# Altium project upper-pcb.PrjPcb
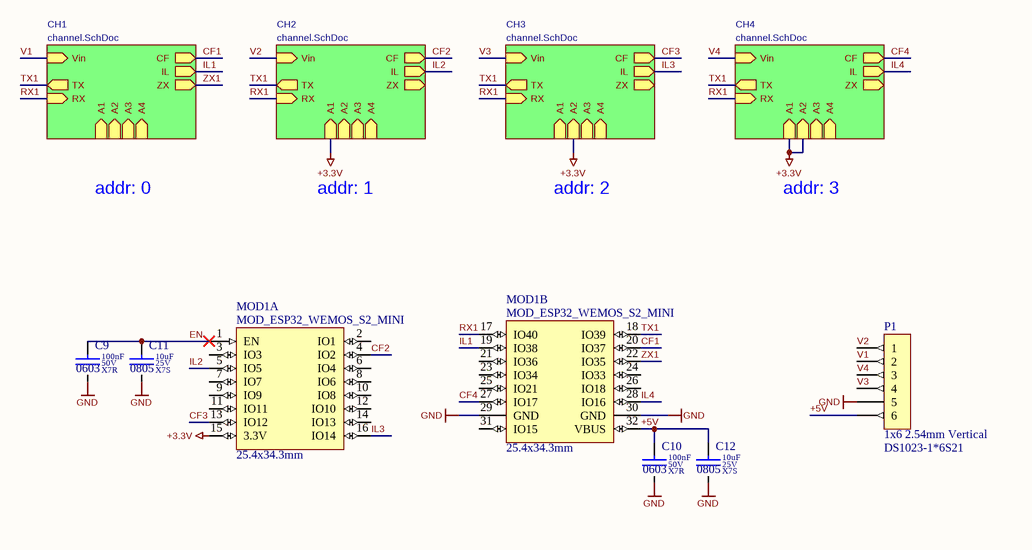
[diagram p0: upper-pcb.SchDoc]
2 sheets, 82 parts. Net scope: hierarchical (ports join the sheet entries above them; power ports are global).
Board file: upper-pcb.PcbDoc
Sheets:
  upper-pcb.SchDoc
    CH1 = channel.SchDoc
    CH2 = channel.SchDoc
    CH3 = channel.SchDoc
    CH4 = channel.SchDoc

## Sheet upper-pcb.SchDoc
size A; SheetNumber: 1; SheetTotal: 2

### Parts
C9  value 100nF  Dielectric: X7R  Voltage: 50V  SCH_Footprint: 0603  [C_0603_1608]  (hidden comment: Ceramic X7R)
C10  value 100nF  Dielectric: X7R  Voltage: 50V  SCH_Footprint: 0603  [C_0603_1608]  (hidden comment: Ceramic X7R)
C11  value 10uF  Dielectric: X7S  Voltage: 25V  SCH_Footprint: 0805  [C_0805_2012]  (hidden comment: Ceramic X7S)
C12  value 10uF  Dielectric: X7S  Voltage: 25V  SCH_Footprint: 0805  [C_0805_2012]  (hidden comment: Ceramic X7S)
MOD1  value MOD_ESP32_WEMOS_S2_MINI  SCH_Footprint: 25.4x34.3mm  [MOD_ESP32_WEMOS_S2_MINI]  (hidden comment: ESP32-S2FN4R2 mini wifi board)  (parts A,B of 2)
P1  value DS1023-1*6S21  SCH_Footprint: 1x6 2.54mm Vertical  [J_HEADER_1x6_2.54_VERTICAL]  (hidden comment: Goldpin female straight)

### Sub-sheets
CH1 = channel.SchDoc: Vin (in), ZX (out), IL (out), CF (out), A1 (in), A2 (in), A3 (in), A4 (in), RX (in), TX (out)
CH2 = channel.SchDoc: Vin (in), ZX (out), IL (out), CF (out), A1 (in), A2 (in), A3 (in), A4 (in), RX (in), TX (out)
CH3 = channel.SchDoc: Vin (in), ZX (out), IL (out), CF (out), A1 (in), A2 (in), A3 (in), A4 (in), RX (in), TX (out)
CH4 = channel.SchDoc: Vin (in), ZX (out), IL (out), CF (out), A1 (in), A2 (in), A3 (in), A4 (in), RX (in), TX (out)

### Nets
+3.3V: MOD1.15(3.3V) ; sheet CH2/A1, sheet CH3/A2, sheet CH4/A1, sheet CH4/A2
GND: C9.2 C10.2 C11.2 C12.2 MOD1.29(GND) MOD1.30(GND) P1.5
+5V: C10.1 C12.1 MOD1.32(VBUS) P1.6
CF1: MOD1.20(IO37) ; sheet CH1/CF
CF2: MOD1.4(IO2) ; sheet CH2/CF
CF3: MOD1.13(IO12) ; sheet CH3/CF
CF4: MOD1.27(IO17) ; sheet CH4/CF
EN: C9.1 C11.1 MOD1.1(EN)
IL1: MOD1.19(IO38) ; sheet CH1/IL
IL2: MOD1.5(IO5) ; sheet CH2/IL
IL3: MOD1.16(IO14) ; sheet CH3/IL
IL4: MOD1.28(IO16) ; sheet CH4/IL
RX1: MOD1.17(IO40) ; sheet CH1/RX, sheet CH2/RX, sheet CH3/RX, sheet CH4/RX
TX1: MOD1.18(IO39) ; sheet CH1/TX, sheet CH2/TX, sheet CH3/TX, sheet CH4/TX
V1: P1.2 ; sheet CH1/Vin
V2: P1.1 ; sheet CH2/Vin
V3: P1.4 ; sheet CH3/Vin
V4: P1.3 ; sheet CH4/Vin
ZX1: MOD1.22(IO35) ; sheet CH1/ZX

Not connected (* = marked no-connect by the designer): MOD1 2(IO1) 3(IO3) 6(IO4) 7(IO7) 8(IO6) 9(IO9) 10(IO8) 11(IO11) 12(IO10) 14(IO13) 21(IO36) 23(IO34) 24(IO33) 25(IO21) 26(IO18) 31(IO15)

### Notes on the sheet
- addr: 0
- addr: 1
- addr: 2
- addr: 3

### Library data of the parts
C9 C10 = C_100nF_50V_X7R_0603_5: Capacitor; Manufacturer: Samsung; Manufacturer Part Number: CL10B104JB8NNNC; Tolerance (%): 5; Part Number: C_100nF_50V_X7R_0603_5; HelpURL: http://www.tme.eu/pl/Document/4a42202b32dab16128fe107dd69598cc/samsung-chip-cap.pdf; Supplier 1: TME; Supplier Part Number 1: CL10B104JB8NNNC; Supplier 2: RS Components; Supplier Part Number 2: 7665455; Supplier 3: Farnell; Supplier 4: Mouser; Supplier 5: Digi-Key; Supplier Part Number 5: 1276-1033-1-ND; Supplier 6: LCSC; Supplier Part Number 6: C24452
C11 C12 = C_10uF_25V_X7S_0805_10: Capacitor; Manufacturer: Murata; Manufacturer Part Number: GRT21BC71E106KE13L; Tolerance (%): 10; Part Number: C_10uF_25V_X7S_0805_10; HelpURL: https://eu.mouser.com/datasheet/2/281/1/GRT21BC71E106KE13_01A-3158174.pdf; Supplier 1: TME; Supplier Part Number 1: GRT21BC71E106KE13L; Supplier 2: RS Components; Supplier Part Number 2: 2478205; Supplier 3: Farnell; Supplier Part Number 3: 3790456; Supplier 4: Mouser; Supplier Part Number 4: 81-GRT21BC71E106KE13; Supplier 5: Digi-Key; Supplier Part Number 5: 490-GRT21BC71E106KE13LCT-ND; Supplier 6: LCSC
MOD1 = MOD_ESP32_WEMOS_S2_MINI: Manufacturer: Wemos; Part Number: MOD_ESP32_WEMOS_S2_MINI; HelpURL: https://www.wemos.cc/en/latest/s2/s2_mini.html; Manufacturer Part Number: MOD_ESP32_WEMOS_S2_MINI; Supplier 1: TME; Supplier 2: RS Components; Supplier 3: Farnell; Supplier 4: Mouser; Supplier 5: Digi-Key; Supplier 6: LCSC; Supplier 7: Aliexpress; Supplier Part Number 7: https://pl.aliexpress.com/item/1005003145192016.html
P1 = J_HEADER_1x6_2.54_VERTICAL: Pin Header; Manufacturer: Connfly; Part Number: J_HEADER_1x6_2.54_VERTICAL; HelpURL: https://www.tme.eu/Document/584b1a60cf2e8809a936c5f5ff2de0d5/zl262-sg.pdf; Manufacturer Part Number: DS1023-1*6S21; Supplier 1: TME; Supplier Part Number 1: ZL262-6SG; Supplier 2: RS Components; Supplier 3: Farnell; Supplier 4: Mouser; Supplier 5: Digi-Key; Supplier 6: LCSC

## Sheet channel.SchDoc
size A; SheetNumber: 2; SheetTotal: 2
Used 4 times, as channels CH1, CH2, CH3, CH4. Parts and nets are listed once, with the designators drawn on the sheet.
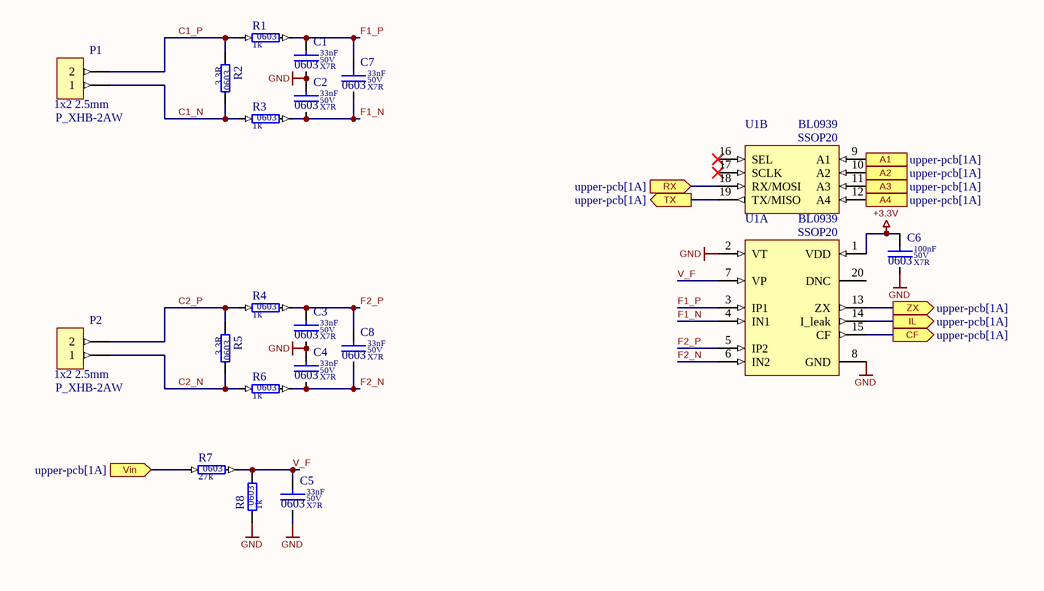
[diagram p1: channel.SchDoc]

### Parts
C1  value 33nF  Dielectric: X7R  Voltage: 50V  SCH_Footprint: 0603  [C_0603_1608]  (hidden comment: Ceramic X7R)
C2  value 33nF  Dielectric: X7R  Voltage: 50V  SCH_Footprint: 0603  [C_0603_1608]  (hidden comment: Ceramic X7R)
C3  value 33nF  Dielectric: X7R  Voltage: 50V  SCH_Footprint: 0603  [C_0603_1608]  (hidden comment: Ceramic X7R)
C4  value 33nF  Dielectric: X7R  Voltage: 50V  SCH_Footprint: 0603  [C_0603_1608]  (hidden comment: Ceramic X7R)
C5  value 33nF  Dielectric: X7R  Voltage: 50V  SCH_Footprint: 0603  [C_0603_1608]  (hidden comment: Ceramic X7R)
C6  value 100nF  Dielectric: X7R  Voltage: 50V  SCH_Footprint: 0603  [C_0603_1608]  (hidden comment: Ceramic X7R)
C7  value 33nF  Dielectric: X7R  Voltage: 50V  SCH_Footprint: 0603  [C_0603_1608]  (hidden comment: Ceramic X7R)
C8  value 33nF  Dielectric: X7R  Voltage: 50V  SCH_Footprint: 0603  [C_0603_1608]  (hidden comment: Ceramic X7R)
P1  value P_XHB-2AW  SCH_Footprint: 1x2 2.5mm  [P_XHB-2AW]  (hidden comment: XHB)
P2  value P_XHB-2AW  SCH_Footprint: 1x2 2.5mm  [P_XHB-2AW]  (hidden comment: XHB)
R1  value 1k  SCH_Footprint: 0603  [R_0603_1608]  (hidden comment: Resistor)
R2  value 3.3R  SCH_Footprint: 0603  [R_0603_1608]  (hidden comment: Resistor)
R3  value 1k  SCH_Footprint: 0603  [R_0603_1608]  (hidden comment: Resistor)
R4  value 1k  SCH_Footprint: 0603  [R_0603_1608]  (hidden comment: Resistor)
R5  value 3.3R  SCH_Footprint: 0603  [R_0603_1608]  (hidden comment: Resistor)
R6  value 1k  SCH_Footprint: 0603  [R_0603_1608]  (hidden comment: Resistor)
R7  value 27k  SCH_Footprint: 0603  [R_0603_1608]  (hidden comment: Resistor)
R8  value 1k  SCH_Footprint: 0603  [R_0603_1608]  (hidden comment: Resistor)
U1  value BL0939  SCH_Footprint: SSOP20  [SSOP20_3.9x8.65]  (hidden comment: Electrical mains 2-ch power meter)  (parts A,B of 2)

### Ports
A1 (in, see upper-pcb[1A]), A2 (in, see upper-pcb[1A]), A3 (in, see upper-pcb[1A]), A4 (in, see upper-pcb[1A]), CF (out, see upper-pcb[1A]), IL (out, see upper-pcb[1A]), RX (in, see upper-pcb[1A]), TX (out, see upper-pcb[1A]), Vin (in, see upper-pcb[1A]), ZX (out, see upper-pcb[1A])

### Nets
+3.3V: C6.1 U1.1(VDD)
GND: C1.2 C2.1 C3.2 C4.1 C5.2 C6.2 R8.1 U1.2(VT) U1.8(GND)
A1: U1.9(A1) ; port A1
A2: U1.10(A2) ; port A2
A3: U1.11(A3) ; port A3
A4: U1.12(A4) ; port A4
C1_N: P1.1 R2.2 R3.1
C1_P: P1.2 R1.1 R2.1
C2_N: P2.1 R5.2 R6.1
C2_P: P2.2 R4.1 R5.1
CF: U1.15(CF) ; port CF
F1_N: C2.2 C7.2 R3.2 U1.4(IN1)
F1_P: C1.1 C7.1 R1.2 U1.3(IP1)
F2_N: C4.2 C8.2 R6.2 U1.6(IN2)
F2_P: C3.1 C8.1 R4.2 U1.5(IP2)
IL: U1.14(I_leak) ; port IL
RX: U1.18(RX/MOSI) ; port RX
TX: U1.19(TX/MISO) ; port TX
V_F: C5.1 R7.2 R8.2 U1.7(VP)
Vin: R7.1 ; port Vin
ZX: U1.13(ZX) ; port ZX

Not connected (* = marked no-connect by the designer): U1 16(SEL)* 17(SCLK)* 20(DNC)

### Channels
CH1: designators C1=C1_ch1 C2=C2_ch1 C3=C3_ch1 C4=C4_ch1 C5=C5_ch1 C6=C6_ch1 C7=C7_ch1 C8=C8_ch1 P1=P1_CH1 P2=P2_CH1 R1=R1_ch1 R2=R2_ch1 R3=R3_ch1 R4=R4_ch1 R5=R5_ch1 R6=R6_ch1 R7=R7_ch1 R8=R8_ch1 U1=U1_ch1; ports A1=NetU1_ch1_9 A2=NetU1_ch1_10 A3=NetU1_ch1_11 A4=NetU1_ch1_12 CF=CF1 IL=IL1 RX=RX1 TX=TX1 Vin=V1 ZX=ZX1
CH2: designators C1=C1_ch2 C2=C2_ch2 C3=C3_ch2 C4=C4_ch2 C5=C5_ch2 C6=C6_ch2 C7=C7_ch2 C8=C8_ch2 P1=P1_CH2 P2=P2_CH2 R1=R1_ch2 R2=R2_ch2 R3=R3_ch2 R4=R4_ch2 R5=R5_ch2 R6=R6_ch2 R7=R7_ch2 R8=R8_ch2 U1=U1_ch2; ports A1=+3.3V A2=NetU1_ch2_10 A3=NetU1_ch2_11 A4=NetU1_ch2_12 CF=CF2 IL=IL2 RX=RX1 TX=TX1 Vin=V2 ZX=NetU1_ch2_13
CH3: designators C1=C1_ch3 C2=C2_ch3 C3=C3_ch3 C4=C4_ch3 C5=C5_ch3 C6=C6_ch3 C7=C7_ch3 C8=C8_ch3 P1=P1_CH3 P2=P2_CH3 R1=R1_ch3 R2=R2_ch3 R3=R3_ch3 R4=R4_ch3 R5=R5_ch3 R6=R6_ch3 R7=R7_ch3 R8=R8_ch3 U1=U1_ch3; ports A1=NetU1_ch3_9 A2=+3.3V A3=NetU1_ch3_11 A4=NetU1_ch3_12 CF=CF3 IL=IL3 RX=RX1 TX=TX1 Vin=V3 ZX=NetU1_ch3_13
CH4: designators C1=C1_ch4 C2=C2_ch4 C3=C3_ch4 C4=C4_ch4 C5=C5_ch4 C6=C6_ch4 C7=C7_ch4 C8=C8_ch4 P1=P1_CH4 P2=P2_CH4 R1=R1_ch4 R2=R2_ch4 R3=R3_ch4 R4=R4_ch4 R5=R5_ch4 R6=R6_ch4 R7=R7_ch4 R8=R8_ch4 U1=U1_ch4; ports A1=+3.3V A2=+3.3V A3=NetU1_ch4_11 A4=NetU1_ch4_12 CF=CF4 IL=IL4 RX=RX1 TX=TX1 Vin=V4 ZX=NetU1_ch4_13

### Library data of the parts
C1-C5 C7 C8 = C_33nF_50V_X7R_0603_10: Capacitor; Manufacturer: Yageo; Manufacturer Part Number: CC0603KRX7R9BB333; Tolerance (%): 10; Part Number: C_33nF_50V_X7R_0603_10; HelpURL: https://datasheet.octopart.com/CC0603KRX7R9BB333-Yageo-datasheet-10883670.pdf; Supplier 1: TME; Supplier 2: RS Components; Supplier 3: Farnell; Supplier 4: Mouser; Supplier 5: Digi-Key; Supplier 6: LCSC
C6 = C_100nF_50V_X7R_0603_5: as C9 on sheet upper-pcb; Part Number: C_100nF_50V_X7R_0603_5; HelpURL: http://www.tme.eu/pl/Document/4a42202b32dab16128fe107dd69598cc/samsung-chip-cap.pdf; Supplier 1: TME; Supplier Part Number 1: CL10B104JB8NNNC; Supplier 2: RS Components; Supplier Part Number 2: 7665455; Supplier 3: Farnell; Supplier 4: Mouser; Supplier 5: Digi-Key; Supplier Part Number 5: 1276-1033-1-ND; Supplier 6: LCSC; Supplier Part Number 6: C24452
P1 P2 = P_XHB-2AW: Pin Header; Part Number: P_XHB-2AW; HelpURL: https://datasheet.lcsc.com/lcsc/2307111607_HCTL-HC-XHB-2AW_C3011964.pdf; Manufacturer: -; Manufacturer Part Number: P_XHB-2AW; Supplier 1: TME; Supplier 2: RS Components; Supplier 3: Farnell; Supplier 4: Mouser; Supplier 5: Digi-Key; Supplier 6: LCSC; Supplier Part Number 6: C248901; Supplier 7: JLCPCB; Supplier Part Number 7: C3011964
R1 R3 R4 R6 R8 = R_1k_0603_1: Manufacturer: Vishay; Manufacturer Part Number: CRCW06031K00FKEA; Voltage: 75V; Power: 100mW; Tolerance: 1%; Part Number: R_1k_0603_1; HelpURL: http://www.farnell.com/datasheets/2310790.pdf?_ga=2.256888843.1690599162.1548417389-1379097396.1542296996&_gac=1.262631934.1547230258.Cj0KCQiAmuHhBRD0ARIsAFWyPwhX8HcvXnM3tA0ZBodZLzDIjH2ZxLpjT5LWo9bad_HPRbU8LfPq44UaAhEwEALw_wcB; Supplier 1: TME; Supplier 2: RS Components; Supplier Part Number 2: 678-9875P; Supplier 3: Farnell; Supplier Part Number 3: 1469740; Supplier 4: Mouser; Supplier Part Number 4: 71-CRCW0603-1.0K-E3; Supplier 5: Digi-Key; Supplier Part Number 5: 541-1.00KHCT-ND; Supplier 6: LCSC
R2 R5 = R_3.3R_0603_5: Manufacturer: Yageo; Manufacturer Part Number: RC0603JR-073R3L; Voltage: 50V; Power: 100mW; Tolerance: 5%; Part Number: R_3.3R_0603_5; HelpURL: https://datasheet.octopart.com/RC0603JR-073R3L-Yageo-datasheet-8328172.pdf; Supplier 1: TME; Supplier Part Number 1: RC0603JR-073R3; Supplier 2: RS Components; Supplier 3: Farnell; Supplier 4: Mouser; Supplier Part Number 4: 603-RC0603JR-073R3L; Supplier 5: Digi-Key; Supplier Part Number 5: 311-3.3GRCT-ND; Supplier 6: LCSC
R7 = R_27k_0603_1: Manufacturer: Vishay; Manufacturer Part Number: CRCW060327K0FKEA; Voltage: 75V; Power: 100mW; Tolerance: 1%; Part Number: R_27k_0603_1; HelpURL: http://www.farnell.com/datasheets/2310790.pdf?_ga=2.12382260.1690599162.1548417389-1379097396.1542296996&_gac=1.51852635.1547230258.Cj0KCQiAmuHhBRD0ARIsAFWyPwhX8HcvXnM3tA0ZBodZLzDIjH2ZxLpjT5LWo9bad_HPRbU8LfPq44UaAhEwEALw_wcB; Supplier 1: TME; Supplier 2: RS Components; Supplier Part Number 2: 679-0087; Supplier 3: Farnell; Supplier Part Number 3: 1652864; Supplier 4: Mouser; Supplier Part Number 4: 71-CRCW0603-27K-E3; Supplier 5: Digi-Key; Supplier Part Number 5: 541-27.0KHCT-ND; Supplier 6: LCSC
U1 = U_BL0939: Manufacturer: Belling; Part Number: U_BL0939; HelpURL: https://www.belling.com.cn/media/file_object/bel_product/BL0939/datasheet/BL0939_V1.2_cn.pdf; Manufacturer Part Number: BL0939; Supplier 1: TME; Supplier 2: RS Components; Supplier 3: Farnell; Supplier 4: Mouser; Supplier 5: Digi-Key; Supplier 6: LCSC; Supplier Part Number 6: C2841044; Supplier 7: Aliexpress; Supplier Part Number 7: BL0939

## Nets that join several sheets
+3.3V: upper-pcb (MOD1.15), CH1 (C6_ch1.1 U1_ch1.1), CH2 (C6_ch2.1 U1_ch2.1 U1_ch2.9), CH3 (C6_ch3.1 U1_ch3.1 U1_ch3.10), CH4 (C6_ch4.1 U1_ch4.1 U1_ch4.9 U1_ch4.10)
GND: upper-pcb (7 pins), CH1 (9 pins), CH2 (9 pins), CH3 (9 pins), CH4 (9 pins)
CF1: upper-pcb (MOD1.20), CH1 (U1_ch1.15)
CF2: upper-pcb (MOD1.4), CH2 (U1_ch2.15)
CF3: upper-pcb (MOD1.13), CH3 (U1_ch3.15)
CF4: upper-pcb (MOD1.27), CH4 (U1_ch4.15)
IL1: upper-pcb (MOD1.19), CH1 (U1_ch1.14)
IL2: upper-pcb (MOD1.5), CH2 (U1_ch2.14)
IL3: upper-pcb (MOD1.16), CH3 (U1_ch3.14)
IL4: upper-pcb (MOD1.28), CH4 (U1_ch4.14)
RX1: upper-pcb (MOD1.17), CH1 (U1_ch1.18), CH2 (U1_ch2.18), CH3 (U1_ch3.18), CH4 (U1_ch4.18)
TX1: upper-pcb (MOD1.18), CH1 (U1_ch1.19), CH2 (U1_ch2.19), CH3 (U1_ch3.19), CH4 (U1_ch4.19)
V1: upper-pcb (P1.2), CH1 (R7_ch1.1)
V2: upper-pcb (P1.1), CH2 (R7_ch2.1)
V3: upper-pcb (P1.4), CH3 (R7_ch3.1)
V4: upper-pcb (P1.3), CH4 (R7_ch4.1)
ZX1: upper-pcb (MOD1.22), CH1 (U1_ch1.13)